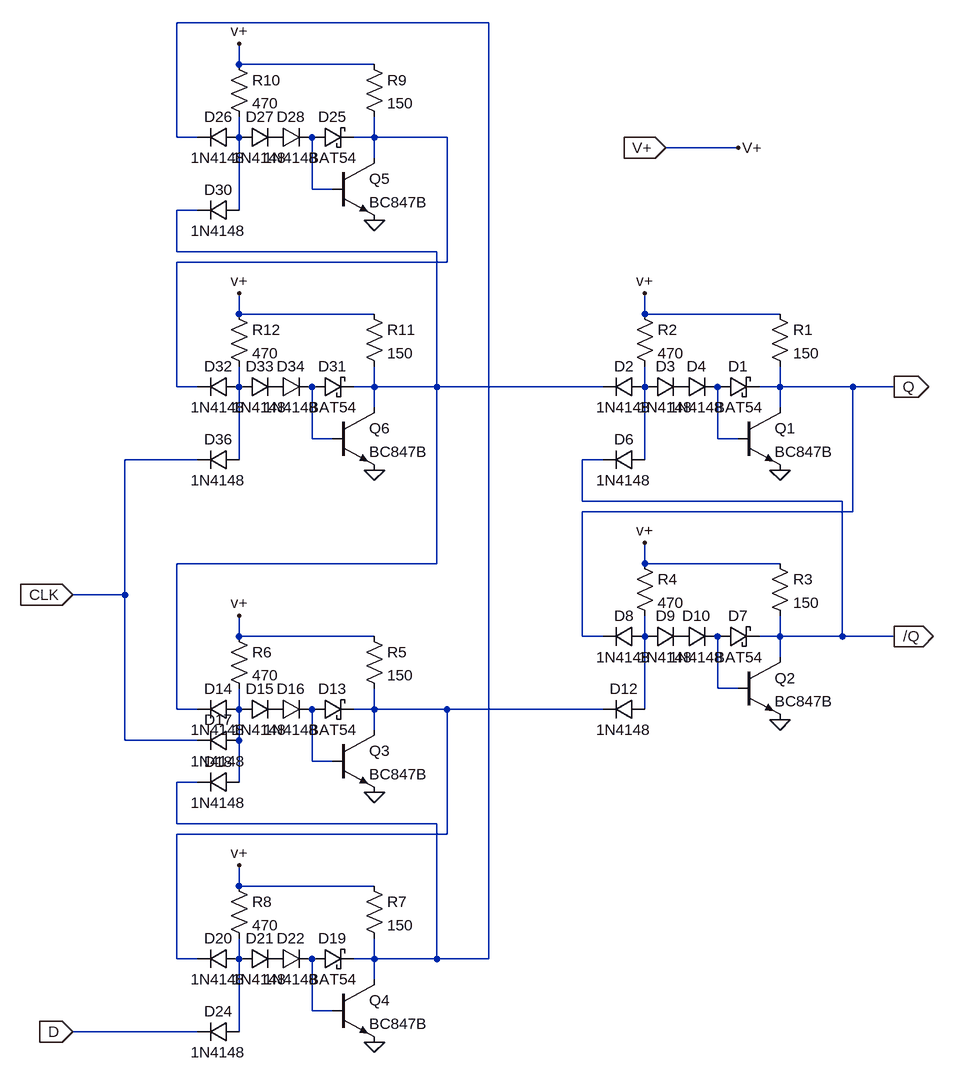
[diagram p0: schematic FF.asc]
FF.asc, the LTspice schematic file:
Version 4
SHEET 1 2652 1036
WIRE 1952 -832 1472 -832
WIRE 1568 -768 1568 -800
WIRE 1776 -768 1568 -768
WIRE 1472 -656 1472 -832
WIRE 1504 -656 1472 -656
WIRE 1568 -656 1568 -688
WIRE 1632 -656 1616 -656
WIRE 1680 -656 1664 -656
WIRE 1776 -656 1776 -688
WIRE 1776 -656 1744 -656
WIRE 1888 -656 1776 -656
WIRE 2336 -640 2224 -640
WIRE 1776 -624 1776 -656
WIRE 1680 -576 1680 -656
WIRE 1712 -576 1680 -576
WIRE 1504 -544 1472 -544
WIRE 1568 -544 1568 -656
WIRE 1472 -480 1472 -544
WIRE 1872 -480 1472 -480
WIRE 1888 -464 1888 -656
WIRE 1888 -464 1472 -464
WIRE 1568 -384 1568 -416
WIRE 1776 -384 1568 -384
WIRE 2192 -384 2192 -416
WIRE 2400 -384 2192 -384
WIRE 1472 -272 1472 -464
WIRE 1504 -272 1472 -272
WIRE 1568 -272 1568 -304
WIRE 1632 -272 1616 -272
WIRE 1680 -272 1664 -272
WIRE 1776 -272 1776 -304
WIRE 1776 -272 1744 -272
WIRE 1872 -272 1872 -480
WIRE 1872 -272 1776 -272
WIRE 2128 -272 1872 -272
WIRE 2192 -272 2192 -304
WIRE 2256 -272 2240 -272
WIRE 2304 -272 2288 -272
WIRE 2400 -272 2400 -304
WIRE 2400 -272 2368 -272
WIRE 2512 -272 2400 -272
WIRE 2576 -272 2512 -272
WIRE 1776 -240 1776 -272
WIRE 2400 -240 2400 -272
WIRE 1680 -192 1680 -272
WIRE 1712 -192 1680 -192
WIRE 2304 -192 2304 -272
WIRE 2336 -192 2304 -192
WIRE 1504 -160 1392 -160
WIRE 1568 -160 1568 -272
WIRE 2128 -160 2096 -160
WIRE 2192 -160 2192 -272
WIRE 2096 -96 2096 -160
WIRE 2496 -96 2096 -96
WIRE 2512 -80 2512 -272
WIRE 2512 -80 2096 -80
WIRE 1872 0 1872 -272
WIRE 1872 0 1472 0
WIRE 2192 0 2192 -32
WIRE 2400 0 2192 0
WIRE 1392 48 1392 -160
WIRE 1392 48 1312 48
WIRE 1568 112 1568 80
WIRE 1776 112 1568 112
WIRE 2096 112 2096 -80
WIRE 2128 112 2096 112
WIRE 2192 112 2192 80
WIRE 2256 112 2240 112
WIRE 2304 112 2288 112
WIRE 2400 112 2400 80
WIRE 2400 112 2368 112
WIRE 2496 112 2496 -96
WIRE 2496 112 2400 112
WIRE 2576 112 2496 112
WIRE 2400 144 2400 112
WIRE 2304 192 2304 112
WIRE 2336 192 2304 192
WIRE 1472 224 1472 0
WIRE 1504 224 1472 224
WIRE 1568 224 1568 192
WIRE 1632 224 1616 224
WIRE 1680 224 1664 224
WIRE 1776 224 1776 192
WIRE 1776 224 1744 224
WIRE 1888 224 1776 224
WIRE 2128 224 1888 224
WIRE 2192 224 2192 112
WIRE 1776 256 1776 224
WIRE 1392 272 1392 48
WIRE 1504 272 1392 272
WIRE 1568 272 1568 224
WIRE 1680 304 1680 224
WIRE 1712 304 1680 304
WIRE 1504 336 1472 336
WIRE 1568 336 1568 272
WIRE 1472 400 1472 336
WIRE 1872 400 1472 400
WIRE 1888 416 1888 224
WIRE 1888 416 1472 416
WIRE 1568 496 1568 464
WIRE 1776 496 1568 496
WIRE 1472 608 1472 416
WIRE 1504 608 1472 608
WIRE 1568 608 1568 576
WIRE 1632 608 1616 608
WIRE 1680 608 1664 608
WIRE 1776 608 1776 576
WIRE 1776 608 1744 608
WIRE 1872 608 1872 400
WIRE 1872 608 1776 608
WIRE 1952 608 1952 -832
WIRE 1952 608 1872 608
WIRE 1776 640 1776 608
WIRE 1680 688 1680 608
WIRE 1712 688 1680 688
WIRE 1504 720 1312 720
WIRE 1568 720 1568 608
FLAG 2400 -144 0
FLAG 2192 -416 v+
FLAG 2400 240 0
FLAG 2192 -32 v+
FLAG 1776 352 0
FLAG 1568 80 v+
FLAG 1776 736 0
FLAG 1568 464 v+
FLAG 1776 -528 0
FLAG 1568 -800 v+
FLAG 1776 -144 0
FLAG 1568 -416 v+
FLAG 1312 48 CLK
IOPIN 1312 48 In
FLAG 1312 720 D
IOPIN 1312 720 In
FLAG 2576 -272 Q
IOPIN 2576 -272 Out
FLAG 2576 112 /Q
IOPIN 2576 112 Out
FLAG 2336 -640 V+
FLAG 2224 -640 V+
IOPIN 2224 -640 In
SYMBOL npn 2336 -240 R0
SYMATTR InstName Q1
SYMATTR Value BC847B
SYMBOL res 2384 -400 R0
SYMATTR InstName R1
SYMATTR Value 150
SYMBOL res 2176 -400 R0
SYMATTR InstName R2
SYMATTR Value 470
SYMBOL schottky 2304 -256 R270
WINDOW 0 32 32 VTop 2
WINDOW 3 0 32 VBottom 2
SYMATTR InstName D1
SYMATTR Value BAT54
SYMATTR Description Diode
SYMATTR Type diode
SYMBOL diode 2192 -288 R90
WINDOW 0 0 32 VBottom 2
WINDOW 3 32 32 VTop 2
SYMATTR InstName D2
SYMATTR Value 1N4148
SYMBOL diode 2192 -288 M90
WINDOW 0 0 32 VBottom 2
WINDOW 3 32 32 VTop 2
SYMATTR InstName D3
SYMATTR Value 1N4148
SYMBOL diode 2240 -288 M90
WINDOW 0 0 32 VBottom 2
WINDOW 3 32 32 VTop 2
SYMATTR InstName D4
SYMATTR Value 1N4148
SYMBOL diode 2192 -176 R90
WINDOW 0 0 32 VBottom 2
WINDOW 3 32 32 VTop 2
SYMATTR InstName D6
SYMATTR Value 1N4148
SYMBOL npn 2336 144 R0
SYMATTR InstName Q2
SYMATTR Value BC847B
SYMBOL res 2384 -16 R0
SYMATTR InstName R3
SYMATTR Value 150
SYMBOL res 2176 -16 R0
SYMATTR InstName R4
SYMATTR Value 470
SYMBOL schottky 2304 128 R270
WINDOW 0 32 32 VTop 2
WINDOW 3 0 32 VBottom 2
SYMATTR InstName D7
SYMATTR Value BAT54
SYMATTR Description Diode
SYMATTR Type diode
SYMBOL diode 2192 96 R90
WINDOW 0 0 32 VBottom 2
WINDOW 3 32 32 VTop 2
SYMATTR InstName D8
SYMATTR Value 1N4148
SYMBOL diode 2192 96 M90
WINDOW 0 0 32 VBottom 2
WINDOW 3 32 32 VTop 2
SYMATTR InstName D9
SYMATTR Value 1N4148
SYMBOL diode 2240 96 M90
WINDOW 0 0 32 VBottom 2
WINDOW 3 32 32 VTop 2
SYMATTR InstName D10
SYMATTR Value 1N4148
SYMBOL diode 2192 208 R90
WINDOW 0 0 32 VBottom 2
WINDOW 3 32 32 VTop 2
SYMATTR InstName D12
SYMATTR Value 1N4148
SYMBOL npn 1712 256 R0
SYMATTR InstName Q3
SYMATTR Value BC847B
SYMBOL res 1760 96 R0
SYMATTR InstName R5
SYMATTR Value 150
SYMBOL res 1552 96 R0
SYMATTR InstName R6
SYMATTR Value 470
SYMBOL schottky 1680 240 R270
WINDOW 0 32 32 VTop 2
WINDOW 3 0 32 VBottom 2
SYMATTR InstName D13
SYMATTR Value BAT54
SYMATTR Description Diode
SYMATTR Type diode
SYMBOL diode 1568 208 R90
WINDOW 0 0 32 VBottom 2
WINDOW 3 32 32 VTop 2
SYMATTR InstName D14
SYMATTR Value 1N4148
SYMBOL diode 1568 208 M90
WINDOW 0 0 32 VBottom 2
WINDOW 3 32 32 VTop 2
SYMATTR InstName D15
SYMATTR Value 1N4148
SYMBOL diode 1616 208 M90
WINDOW 0 0 32 VBottom 2
WINDOW 3 32 32 VTop 2
SYMATTR InstName D16
SYMATTR Value 1N4148
SYMBOL diode 1568 256 R90
WINDOW 0 0 32 VBottom 2
WINDOW 3 32 32 VTop 2
SYMATTR InstName D17
SYMATTR Value 1N4148
SYMBOL diode 1568 320 R90
WINDOW 0 0 32 VBottom 2
WINDOW 3 32 32 VTop 2
SYMATTR InstName D18
SYMATTR Value 1N4148
SYMBOL npn 1712 640 R0
SYMATTR InstName Q4
SYMATTR Value BC847B
SYMBOL res 1760 480 R0
SYMATTR InstName R7
SYMATTR Value 150
SYMBOL res 1552 480 R0
SYMATTR InstName R8
SYMATTR Value 470
SYMBOL schottky 1680 624 R270
WINDOW 0 32 32 VTop 2
WINDOW 3 0 32 VBottom 2
SYMATTR InstName D19
SYMATTR Value BAT54
SYMATTR Description Diode
SYMATTR Type diode
SYMBOL diode 1568 592 R90
WINDOW 0 0 32 VBottom 2
WINDOW 3 32 32 VTop 2
SYMATTR InstName D20
SYMATTR Value 1N4148
SYMBOL diode 1568 592 M90
WINDOW 0 0 32 VBottom 2
WINDOW 3 32 32 VTop 2
SYMATTR InstName D21
SYMATTR Value 1N4148
SYMBOL diode 1616 592 M90
WINDOW 0 0 32 VBottom 2
WINDOW 3 32 32 VTop 2
SYMATTR InstName D22
SYMATTR Value 1N4148
SYMBOL diode 1568 704 R90
WINDOW 0 0 32 VBottom 2
WINDOW 3 32 32 VTop 2
SYMATTR InstName D24
SYMATTR Value 1N4148
SYMBOL npn 1712 -624 R0
SYMATTR InstName Q5
SYMATTR Value BC847B
SYMBOL res 1760 -784 R0
SYMATTR InstName R9
SYMATTR Value 150
SYMBOL res 1552 -784 R0
SYMATTR InstName R10
SYMATTR Value 470
SYMBOL schottky 1680 -640 R270
WINDOW 0 32 32 VTop 2
WINDOW 3 0 32 VBottom 2
SYMATTR InstName D25
SYMATTR Value BAT54
SYMATTR Description Diode
SYMATTR Type diode
SYMBOL diode 1568 -672 R90
WINDOW 0 0 32 VBottom 2
WINDOW 3 32 32 VTop 2
SYMATTR InstName D26
SYMATTR Value 1N4148
SYMBOL diode 1568 -672 M90
WINDOW 0 0 32 VBottom 2
WINDOW 3 32 32 VTop 2
SYMATTR InstName D27
SYMATTR Value 1N4148
SYMBOL diode 1616 -672 M90
WINDOW 0 0 32 VBottom 2
WINDOW 3 32 32 VTop 2
SYMATTR InstName D28
SYMATTR Value 1N4148
SYMBOL diode 1568 -560 R90
WINDOW 0 0 32 VBottom 2
WINDOW 3 32 32 VTop 2
SYMATTR InstName D30
SYMATTR Value 1N4148
SYMBOL npn 1712 -240 R0
SYMATTR InstName Q6
SYMATTR Value BC847B
SYMBOL res 1760 -400 R0
SYMATTR InstName R11
SYMATTR Value 150
SYMBOL res 1552 -400 R0
SYMATTR InstName R12
SYMATTR Value 470
SYMBOL schottky 1680 -256 R270
WINDOW 0 32 32 VTop 2
WINDOW 3 0 32 VBottom 2
SYMATTR InstName D31
SYMATTR Value BAT54
SYMATTR Description Diode
SYMATTR Type diode
SYMBOL diode 1568 -288 R90
WINDOW 0 0 32 VBottom 2
WINDOW 3 32 32 VTop 2
SYMATTR InstName D32
SYMATTR Value 1N4148
SYMBOL diode 1568 -288 M90
WINDOW 0 0 32 VBottom 2
WINDOW 3 32 32 VTop 2
SYMATTR InstName D33
SYMATTR Value 1N4148
SYMBOL diode 1616 -288 M90
WINDOW 0 0 32 VBottom 2
WINDOW 3 32 32 VTop 2
SYMATTR InstName D34
SYMATTR Value 1N4148
SYMBOL diode 1568 -176 R90
WINDOW 0 0 32 VBottom 2
WINDOW 3 32 32 VTop 2
SYMATTR InstName D36
SYMATTR Value 1N4148

The netlist it stands for:
* FF.asc
Q1 Q N012 0 0 BC847B
R1 v+ Q 150
R2 v+ N010 470
D1 N012 Q BAT54
D2 N010 N006 1N4148
D3 N010 N011 1N4148
D4 N011 N012 1N4148
D6 N010 /Q 1N4148
Q2 /Q N015 0 0 BC847B
R3 v+ /Q 150
R4 v+ N013 470
D7 N015 /Q BAT54
D8 N013 Q 1N4148
D9 N013 N014 1N4148
D10 N014 N015 1N4148
D12 N013 N019 1N4148
Q3 N019 N018 0 0 BC847B
R5 v+ N019 150
R6 v+ N016 470
D13 N018 N019 BAT54
D14 N016 N006 1N4148
D15 N016 N017 1N4148
D16 N017 N018 1N4148
D17 N016 CLK 1N4148
D18 N016 N001 1N4148
Q4 N001 N022 0 0 BC847B
R7 v+ N001 150
R8 v+ N020 470
D19 N022 N001 BAT54
D20 N020 N019 1N4148
D21 N020 N021 1N4148
D22 N021 N022 1N4148
D24 N020 D 1N4148
Q5 N005 N004 0 0 BC847B
R9 v+ N005 150
R10 v+ N002 470
D25 N004 N005 BAT54
D26 N002 N001 1N4148
D27 N002 N003 1N4148
D28 N003 N004 1N4148
D30 N002 N006 1N4148
Q6 N006 N009 0 0 BC847B
R11 v+ N006 150
R12 v+ N007 470
D31 N009 N006 BAT54
D32 N007 N005 1N4148
D33 N007 N008 1N4148
D34 N008 N009 1N4148
D36 N007 CLK 1N4148
.model D D
.lib standard.dio
.model NPN NPN
.model PNP PNP
.lib standard.bjt
.backanno
.end